# Altium schematic sheet Peripherals.SchDoc: Peripherals
size A4; Date: 9/24/2014; Author: P.A.; CompanyName: STMicroelectronics; Organization: Microcontrollers Division; Address1: 12, Rue Jules HOROWITZ; Address2: 38019 Grenoble; Address3: FRANCE; DocumentNumber: MB1209; Revision: D-02; SheetNumber: 6; SheetTotal: 11; Project: STM32F412G-DISCO; ModifiedDate: 6/2/2016
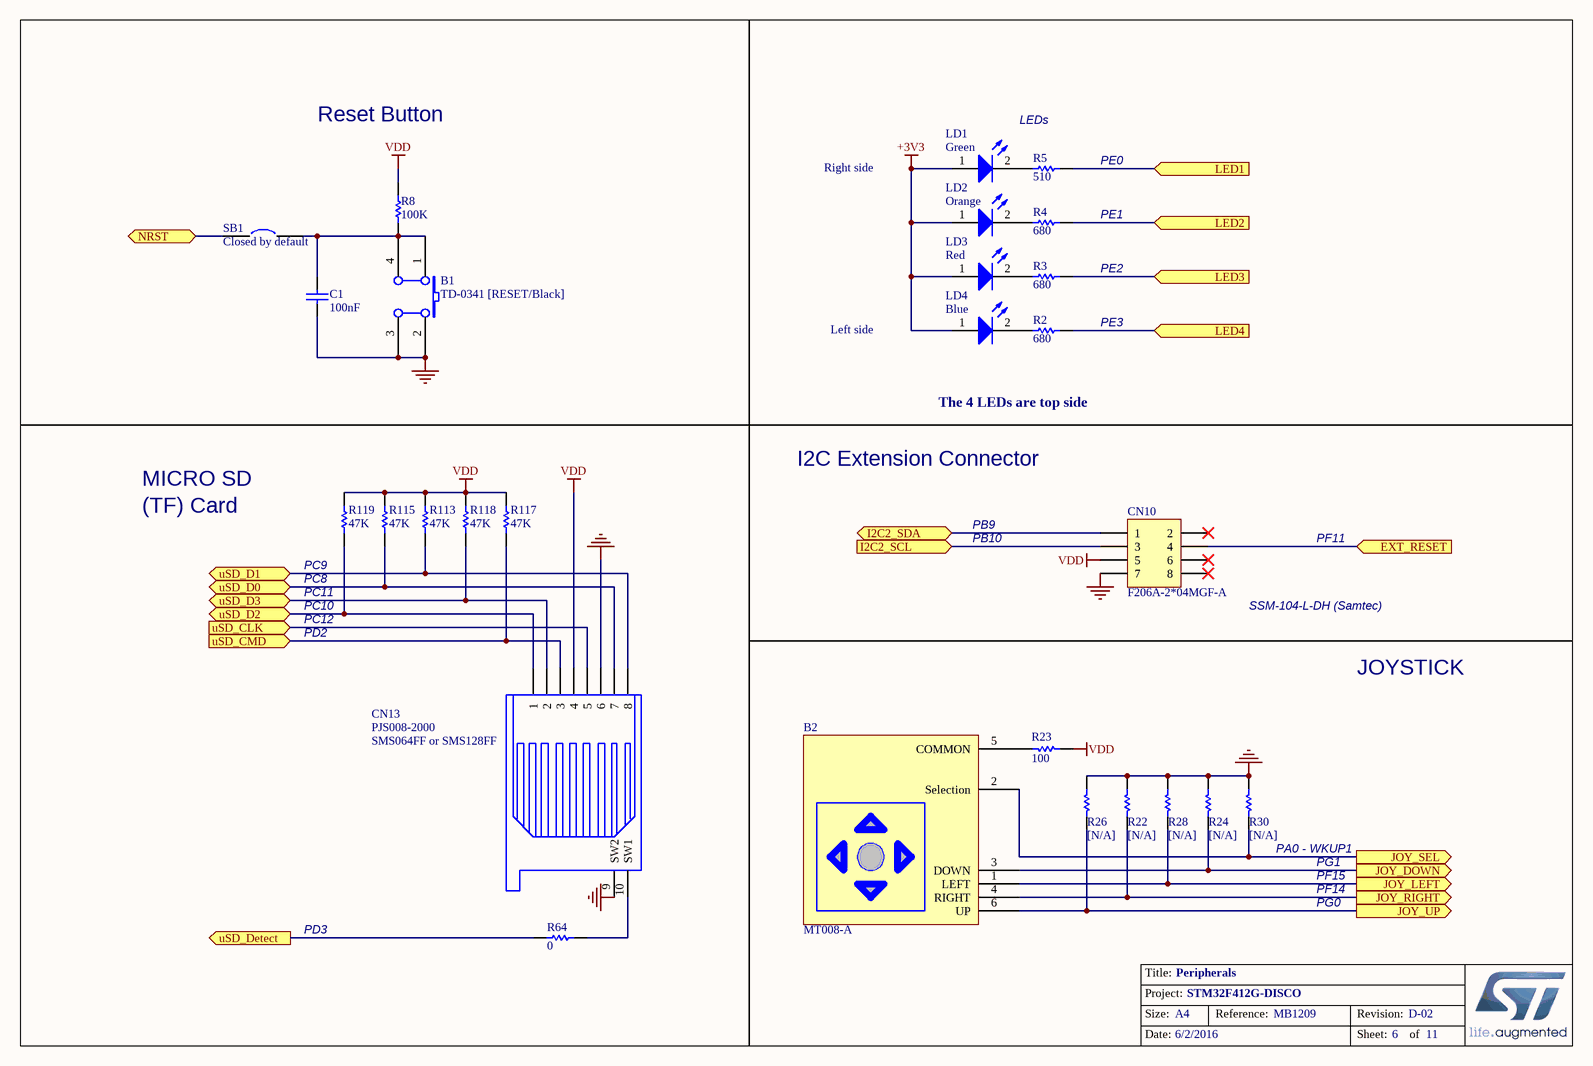
[diagram p0: Peripherals.SchDoc]

## Parts
B1  TD-0341 [RESET/Black]  [PB10]
B2  MT008-A  [MT-008A]
C1  100nF  [0402C]
CN10  F206A-2*04MGF-A  [SSM-104-L-DH]
CN13  PJS008-2000  [MSD_PJS008_]
LD1  Green  [0603D]
LD2  Orange  [0603D]
LD3  Red  [0603D]
LD4  Blue  [0603D]
R2  680  [0402R]
R3  680  [0402R]
R4  680  [0402R]
R5  510  [0603R]
R8  100K  [0402R]
R22  [N/A]  [0402R]
R23  100  [0402R]
R24  [N/A]  [0402R]
R26  [N/A]  [0402R]
R28  [N/A]  [0402R]
R30  [N/A]  [0402R]
R64  0  [SB_0603]
R113  47K  [0402R]
R115  47K  [0402R]
R117  47K  [0402R]
R118  47K  [0402R]
R119  47K  [0402R]
SB1  Closed by default  [SB_0603]

## Ports
EXT_RESET (in), I2C2_SCL (in), I2C2_SDA (bidir), JOY_DOWN (out), JOY_LEFT (out), JOY_RIGHT (out), JOY_SEL (out), JOY_UP (out), LED1 (in), LED2 (in), LED3 (in), LED4 (in), NRST (bidir), uSD_CLK (in), uSD_CMD (in), uSD_D0 (bidir), uSD_D1 (bidir), uSD_D2 (bidir), uSD_D3 (bidir), uSD_Detect (out)

## Nets
+3V3: LD1.1(A) LD2.1(A) LD3.1(A) LD4.1(A)
GND: B1.2(B0) B1.3(B1) C1.1 CN10.7 CN13.6 CN13.9(SW2) R22.2 R24.2 R26.2 R28.2 R30.1
VDD: CN10.5 CN13.4 R8.1 R23.1 R113.1 R115.1 R117.1 R118.1 R119.1
EXT_RESET: CN10.4 ; port EXT_RESET
I2C2_SCL: CN10.3 ; port I2C2_SCL
I2C2_SDA: CN10.1 ; port I2C2_SDA
JOY_DOWN: B2.3(DOWN) R24.1 ; port JOY_DOWN
JOY_LEFT: B2.1(LEFT) R28.1 ; port JOY_LEFT
JOY_RIGHT: B2.4(RIGHT) R22.1 ; port JOY_RIGHT
JOY_SEL: B2.2(Selection) R30.2 ; port JOY_SEL
JOY_UP: B2.6(UP) R26.1 ; port JOY_UP
LED1: R5.1 ; port LED1
LED2: R4.1 ; port LED2
LED3: R3.1 ; port LED3
LED4: R2.1 ; port LED4
NRST: SB1.1 ; port NRST
uSD_CLK: CN13.5 ; port uSD_CLK
uSD_CMD: CN13.3 R117.2 ; port uSD_CMD
uSD_D0: CN13.7 R115.2 ; port uSD_D0
uSD_D1: CN13.8 R113.2 ; port uSD_D1
uSD_D2: CN13.1 R119.2 ; port uSD_D2
uSD_D3: CN13.2 R118.2 ; port uSD_D3
uSD_Detect: R64.1 ; port uSD_Detect
NetB1_1: B1.1(A0) B1.4(A1) C1.2 R8.2 SB1.2
NetB2_5: B2.5(COMMON) R23.2
NetCN13_10: CN13.10(SW1) R64.2
NetLD1_2: LD1.2(K) R5.2
NetLD2_2: LD2.2(K) R4.2
NetLD3_2: LD3.2(K) R3.2
NetLD4_2: LD4.2(K) R2.2

Not connected (* = marked no-connect by the designer): CN10 2* 6* 8*

## Notes on the sheet
- Reset Button
- LEDs
- Right side
- (near R5) PE0
- PE1
- PE2
- PE3
- Left side
- The 4 LEDs are top side
- MICRO SD
- (TF) Card
- I2C Extension Connector
- PB9
- (near R119) PC8
- (near R119) PC9
- PC11
- PB10
- PF11
- PC10
- PC12
- PD2
- (near CN10) SSM-104-L-DH (Samtec)
- JOYSTICK
- (near CN13) SMS064FF or SMS128FF
- (near R30) PA0 - WKUP1
- PG1
- PD3
- PF14
- PF15
- PG0
- Title:
- Project:
- Size:
- Date:
- A4
- Reference:
- Sheet:
- Revision:
- of

## Library data of the parts
B1 = SW PUSHBUTTON: SE PUSHBUTTON; Ordered by: Subcon; Assembly: with Back cap; Silkscreen: RESET; ECCN_US/EU: NA
B2 = MT-008A: Joystick; Ordered by: Subcon; Assembly: with button; ECCN_US/EU: NA; Silkscreen: Joystick
C1 = CAP: Capacitor; Value: 100pF; Ordered by: Subcon; ECCN_US/EU: NA; Published: 8-Jun-2000; Revision: July-2002: Re-released for DXP Platform.; Publisher: Altium Limited
CN10 = SSM-104-L-DH: Header, 5-Pin, Dual row; Manuf_1: SAMTEC; Ordered by: Subcon; Silkscreen: RFEEPROM; ECCN_US/EU: NA; Revision: 17-Jul-2002: Re-released for DXP Platform.; Publisher: Altium Limited; Manuf_Part_1: SSM-104-L-DH
CN13 = SMS016AFA5E: Manuf_1: Yamaichi; Ordered by: Subcon; Silkscreen: uSD; ECCN_US/EU: NA; Manuf_Part_1: PJS008-2000
LD1-LD4 = LED2: Typical RED, GREEN, YELLOW, AMBER GaAs LED; Ordered by: Subcon; ECCN_US/EU: EAR99/NEC; Published: 8-Jun-2000; Revision: July-2002: Re-released for DXP Platform.; Publisher: Altium Limited
R2-R5 R23 R64 = Res1: Resistor; Value: 1K; Ordered by: Subcon; ECCN_US/EU: NA; Published: 8-Jun-2000; Revision: July-2002: Re-released for DXP Platform.; Publisher: Altium Limited
R8 R113 R115 R117-R119 = res1: Resistor; Value: 1K; Ordered by: Subcon; ECCN_US/EU: NA; Published: 8-Jun-2000; Revision: July-2002: Re-released for DXP Platform.; Publisher: Altium Limited
R22 R24 R26 R28 R30 = Res1: Resistor; Value: 1K; Ordered by: Subcon; ECCN_US/EU: NA; Fitted: NO; Published: 8-Jun-2000; Revision: July-2002: Re-released for DXP Platform.; Publisher: Altium Limited
SB1 = Circuit Breaker: Ordered by: Subcon; Comments: Solder bridge; ECCN_US/EU: NA; Published: 24-Mar-1999; Revision: July-2002: Re-released for DXP Platform.; Publisher: Altium Limited